# EAGLE design BleHidKeyboard (EAGLE 7.5.0)
DESIGNER: Adam Green
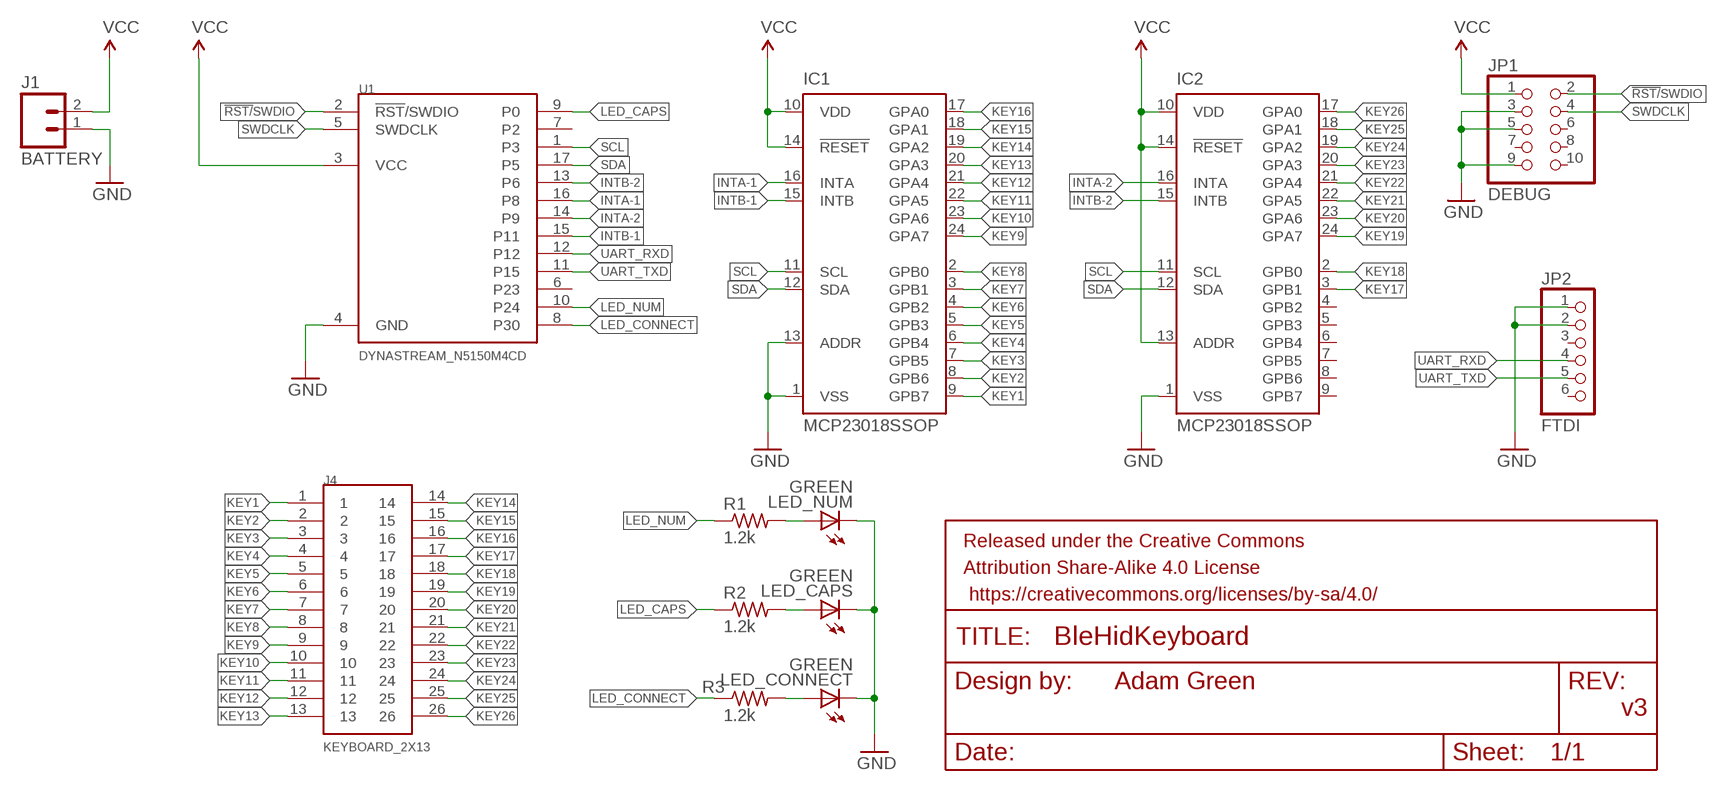
[diagram p0: schematic, sheet 1]

## Parts
IC1  MCP23018SSOP  [SSOP24]
IC2  MCP23018SSOP  [SSOP24]
J1  BATTERY  M021X02_NO_SILK  [1X02_NO_SILK]
J4  KEYBOARD_2X13  [KEYBOARD_2X13]
JP1  DEBUG  FTSH-105  [FTSH-105]
JP2  FTDI  PINHD-1X6CLEAN  [1X06-CLEAN]
LED_CAPS  GREEN  LEDCHIPLED_1206  [CHIPLED_1206]
LED_CONNECT  GREEN  LEDCHIPLED_1206  [CHIPLED_1206]
LED_NUM  GREEN  LEDCHIPLED_1206  [CHIPLED_1206]
R1  1.2k  R-US_R0805  [R0805]
R2  1.2k  R-US_R0805  [R0805]
R3  1.2k  R-US_R0805  [R0805]
U1  DYNASTREAM_N5150M4CD  [N5150M4CD]

## Nets
!RST/!SWDIO: JP1.2 U1.2(!RST!/SWDIO)
GND [POWER]: IC1.1(VSS) IC1.13(ADDR) IC2.1(VSS) J1.1 JP1.3 JP1.5 JP1.9 JP2.1 JP2.2 LED_CAPS.C LED_CONNECT.C LED_NUM.C U1.4(GND)
INTA-1: IC1.16(INTA) U1.16(P8)
INTA-2: IC2.16(INTA) U1.14(P9)
INTB-1: IC1.15(INTB) U1.15(P11)
INTB-2: IC2.15(INTB) U1.13(P6)
KEY1: IC1.9(GPB7) J4.1
KEY2: IC1.8(GPB6) J4.2
KEY3: IC1.7(GPB5) J4.3
KEY4: IC1.6(GPB4) J4.4
KEY5: IC1.5(GPB3) J4.5
KEY6: IC1.4(GPB2) J4.6
KEY7: IC1.3(GPB1) J4.7
KEY8: IC1.2(GPB0) J4.8
KEY9: IC1.24(GPA7) J4.9
KEY10: IC1.23(GPA6) J4.10
KEY11: IC1.22(GPA5) J4.11
KEY12: IC1.21(GPA4) J4.12
KEY13: IC1.20(GPA3) J4.13
KEY14: IC1.19(GPA2) J4.14
KEY15: IC1.18(GPA1) J4.15
KEY16: IC1.17(GPA0) J4.16
KEY17: IC2.3(GPB1) J4.17
KEY18: IC2.2(GPB0) J4.18
KEY19: IC2.24(GPA7) J4.19
KEY20: IC2.23(GPA6) J4.20
KEY21: IC2.22(GPA5) J4.21
KEY22: IC2.21(GPA4) J4.22
KEY23: IC2.20(GPA3) J4.23
KEY24: IC2.19(GPA2) J4.24
KEY25: IC2.18(GPA1) J4.25
KEY26: IC2.17(GPA0) J4.26
LED_CAPS: R2.1 U1.9(P0)
LED_CONNECT: R3.1 U1.8(P30)
LED_NUM: R1.1 U1.10(P24)
N$1: LED_NUM.A R1.2
N$3: LED_CAPS.A R2.2
N$5: LED_CONNECT.A R3.2
SCL: IC1.11(SCL) IC2.11(SCL) U1.1(P3)
SDA: IC1.12(SDA) IC2.12(SDA) U1.17(P5)
SWDCLK: JP1.4 U1.5(SWDCLK)
UART_RXD: JP2.4 U1.12
UART_TXD: JP2.5 U1.11(P15)
VCC [POWER]: IC1.10(VDD) IC1.14(!RESET) IC2.10(VDD) IC2.13(ADDR) IC2.14(!RESET) J1.2 JP1.1 U1.3(VCC)
Unconnected: IC2.4(GPB2) IC2.5(GPB3) IC2.6(GPB4) IC2.7(GPB5) IC2.8(GPB6) IC2.9(GPB7) JP1.6 JP1.7 JP1.8 JP1.10 JP2.3 JP2.6 U1.6(P23) U1.7(P2)

## Notes on the sheet
- v3

## Library data of the parts
IC1 IC2 = adam_custom:MCP23018: http://ww1.microchip.com/downloads/en/DeviceDoc/21952a.pdf Source: http://ww1.microchip.com/downloads/en/DeviceDoc/21952a.pdf
J1 = SparkFun-Connectors:M02: Standard 2-pin 0.1" header. Use with - straight break away headers ( PRT-00116) - right angle break away headers (PRT-00553) - swiss pins (PRT-00743) - machine pins (PRT-00117) - female headers (PRT-00115) Molex polarized connector foot print use with: PRT-08233 with associated crimp pins and housings. 2.54_SCREWTERM for use with PRT-10571. 3.5mm Screw Terminal footprints for PRT-08084 5mm Screw Terminal footprints for use with PRT-08432
J4 = adam_custom:KEYBOARD_2X13
JP1 = adam_custom:FTSH-105: Semtec FSH-105 2x5 SMT Micro Header Commonly used for 10-pin ARM Cortex-M JTAG/SWD Debug Header.
JP2 = adafruit:PINHD-1X6: PIN HEADER
LED_CAPS LED_CONNECT LED_NUM = adafruit:LED: LED OSRAM: - CHIPLED LG R971, LG N971, LY N971, LG Q971, LY Q971, LO R971, LY R971 LH N974, LH R974 LS Q976, LO Q976, LY Q976 LO Q996 - Hyper CHIPLED LW Q18S LB Q993, LB Q99A, LB R99A - SideLED LS A670, LO A670, LY A670, LG A670, LP A670 LB A673, LV A673, LT A673, LW A673 LH A674 LY A675 LS A676, LA A676, LO A676, LY A676, LW A676 LS A679, LY A679, LG A679 - Hyper Micro SIDELED® LS Y876, LA Y876, LO Y876, LY Y876 LT Y87S - SmartLED LW L88C, LW L88S LB L89C, LB L89S, LG L890 LS L89K, LO L89K, LY L89K LS L896, LA L896, LO L896, LY L896 - TOPLED LS T670, LO T670, LY T670, LG T670, LP T670 LSG T670, LSP T670, LSY T670, LOP T670, LYG T670 LG T671, LOG T671, LSG T671 LB T673, LV T673, LT T673, LW T673 LH T674 LS T676, LA T676, LO T676, LY T676, LB T676, LH T676, LSB T676, LW T676 LB T67C, LV T67C, LT T67C, LS T67K, LO T67K, LY T67K, LW E67C LS E67B, LA E67B, LO E67B, LY E67B, LB E67C, LV E67C, LT E67C LW T67C LS T679, LY T679, LG T679 LS T770, LO T770, LY T770, LG T770, LP T770 LB T773, LV T773, LT T773, LW T773 LH T774 LS E675, LA E675, LY E675, LS T675 LS T776, LA T776, LO T776, LY T776, LB T776 LHGB T686 LT T68C, LB T68C - Hyper Mini TOPLED® LB M676 - Mini TOPLED Santana® LG M470 LS M47K, LO M47K, LY M47K Source: http://www.osram.convergy.de/
R1-R3 = rcl:R-US_: RESISTOR, American symbol
U1 = adam_custom:DYNASTREAM_N5150M4CD

## Net classes
0 default: width 0.152 mm, clearance 0.152 mm
1 POWER: width 0.254 mm, clearance 0.152 mm

## Board
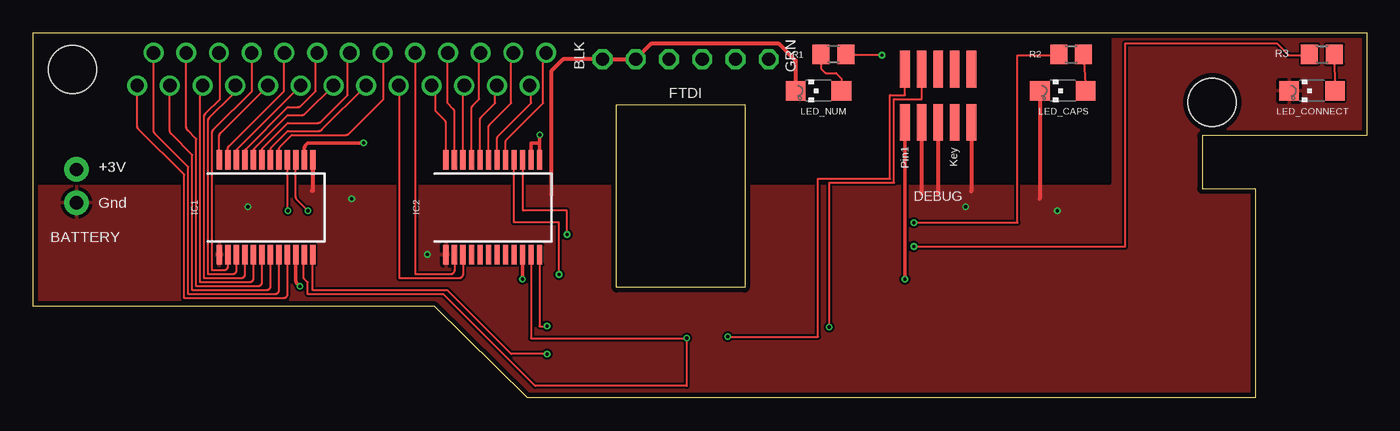
[diagram p1: board, top side]
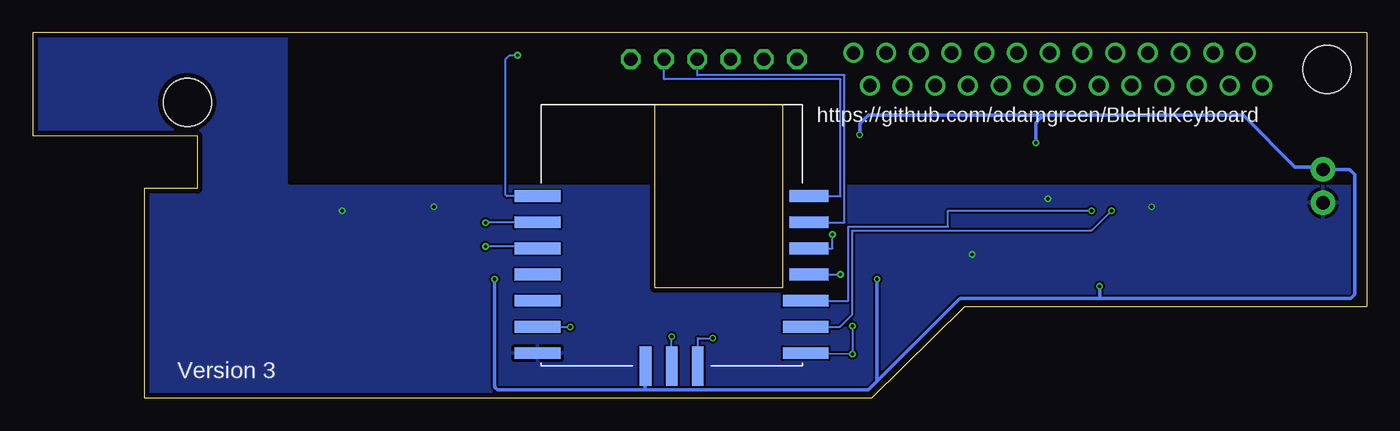
[diagram p2: board, bottom side, seen from below]

Size 101.98 x 27.94 mm. Coordinates in mm from the lower left corner, seen from the top.
Outline: 0,27.94 0,6.99 30.73,6.99 37.85,0 93.47,0 93.47,16 89.41,16 89.41,20.07 101.98,20.07 101.98,27.94 0,27.94
Copper layers (1*16): Top 0.035559375mm / dielectric 1.6mm / Bottom 0.035559375mm
Design rules "oshpark-2layer": minimum track width 6mil, minimum drill 10mil, track to track 6mil, track to pad 6mil, pad to pad 6mil, via to via 6mil, smd to smd 6mil, copper to edge 15mil, drill to drill 6mil, minimum pad ring 5mil, minimum via ring 5mil, stop-mask expansion 2.5mil, vias tented up to drill 0mil, thermal gap 10mil
Holes 3.68 mm at 3.05,25.15 90.17,22.61

### Footprints (pad centres in the part's own frame; a part is rotated, then mirrored left to right if it is on the bottom)
SSOP24 = smd 0.4 x 1.5: 1 -4.225,-3.625; 2 -3.575,-3.625; 3 -2.925,-3.625; 4 -2.275,-3.625; 5 -1.625,-3.625; 6 -0.975,-3.625; 7 -0.325,-3.625; 8 0.325,-3.625; 9 0.975,-3.625; 10 1.625,-3.625; 11 2.275,-3.625; 12 2.925,-3.625; 13 2.925,3.625; 14 2.275,3.625; 15 1.625,3.625; 16 0.975,3.625; 17 0.325,3.625; 18 -0.325,3.625; 19 -0.975,3.625; 20 -1.625,3.625; 21 -2.275,3.625; 22 -2.925,3.625; 23 -3.575,3.625; 24 -4.225,3.625
1X02_NO_SILK = drill 1.016 pad 1.88: 1 0,0; 2 2.54,0
KEYBOARD_2X13 = drill 1.016: 1 -15,-1.25; 2 -13.75,1.25; 3 -12.5,-1.25; 4 -11.25,1.25; 5 -10,-1.25; 6 -8.75,1.25; 7 -7.5,-1.25; 8 -6.25,1.25; 9 -5,-1.25; 10 -3.75,1.25; 11 -2.5,-1.25; 12 -1.25,1.25; 13 0,-1.25; 14 1.25,1.25; 15 2.5,-1.25; 16 3.75,1.25; 17 5,-1.25; 18 6.25,1.25; 19 7.5,-1.25; 20 8.75,1.25; 21 10,-1.25; 22 11.25,1.25; 23 12.5,-1.25; 24 13.75,1.25; 25 15,-1.25; 26 16.25,1.25
FTSH-105 = smd 0.737 x 2.794: 1 -2.54,-2.032; 2 -2.54,2.032; 3 -1.27,-2.032; 4 -1.27,2.032; 5 0,-2.032; 6 0,2.032; 7 1.27,-2.032; 8 1.27,2.032; 9 2.54,-2.032; 10 2.54,2.032
1X06-CLEAN = drill 1.016 octagon: 1 -6.35,0; 2 -3.81,0; 3 -1.27,0; 4 1.27,0; 5 3.81,0; 6 6.35,0
CHIPLED_1206 = smd 1.5 x 1.5: A 0,-1.75; C 0,1.75
R0805 = smd 1.3 x 1.5: 1 -0.95,0; 2 0.95,0
N5150M4CD = smd 0.9 x 3 bottom: 1 -2,-10; 2 0,-10; 3 2,-10 | smd 3.5 x 0.9 bottom: 4 10.25,-9; 5 10.25,-7; 6 10.25,-5; 7 10.25,-3; 8 10.25,-1; 9 10.25,1; 10 10.25,3; 15 -10.25,-5; 16 -10.25,-7; 17 -10.25,-9 | smd 3 x 0.9 bottom: 11 -10.5,3; 12 -10.5,1; 13 -10.5,-1; 14 -10.5,-3

### Placement (x,y rotation side)
IC1  18.49,14.58 0 top
IC2  35.81,14.58 0 top
J1  3.35,14.94 90 top
J4  22.99,25.15 0 top
JP1  69.22,23.11 0 top
JP2  49.91,25.91 0 top
LED_CAPS  78.74,23.5 90 top
LED_CONNECT  97.79,23.5 90 top
LED_NUM  60.07,23.5 90 top
R1  61.21,26.29 180 top
R2  79.38,26.29 0 top
R3  98.55,26.29 0 top
U1  53.14,12.43 0 top

### Tracks (layer width: path | path; a pad name or v marks a point on that pad's centre or on a via)
!RST/!SWDIO  (via drill 0.25)
  Top 0.152: v53.14,4.69 60.05,4.69 60.05,16.76 65.53,16.76 65.53,23.16 66.67,23.16 JP1.2
  Bottom 0.152: U1.2 v53.14,4.69
GND  (via drill 0.25)
  Top 0.305: JP1.3 67.94,15.61 | JP1.5 69.22,15.61 | JP1.9 71.75,15.8 | LED_CAPS.C 76.99,15.25 | 39.62,15.54 39.62,24.99 40.54,25.91 JP2.1 JP2.2 47.32,27.13 57,27.13 58.32,25.8 LED_NUM.C | IC1.13 21.42,15.85 21.34,15.85
  other vias: 16.46,14.63 24.38,15.24 30.18,10.97 71.32,14.63 78.33,14.33
  pour Bottom: 0,16.15 82.28,16.15 arc90 82.6,16.47 82.6,28.04 101.79,28.04 arc-90 102.11,27.72 102.11,19.81 89.61,19.81 arc-90 89.31,20.12 89.31,15.85 93.57,15.85 93.57,0 37.8,0 30.78,7.01 0.32,7.01 arc-90 0,7.33
  pour Top: 0,16.15 82.28,16.15 arc90 82.6,16.47 82.6,27.74 101.79,27.74 arc-90 102.11,27.42 102.11,20.12 89.61,20.12 arc90 89.31,19.81 89.31,16.15 92.95,16.15 arc-90 93.27,15.84 93.27,0 37.8,0 30.78,7.01 0.32,7.01 arc-90 0,7.33
INTA-1  (via drill 0.25 pad 0.51)
  Top 0.152: v19.51,14.33 19.51,18.11 arc45 IC1.16
  Bottom 0.152: v19.51,14.33 20.94,12.89 arc45 21.16,12.8 39.32,12.8 39.32,6.4 40.29,5.43 U1.16
INTA-2  (via drill 0.25)
  Top 0.152: 36.8,18.17 arc45 IC2.16 36.78,13.44 40.23,13.44 v40.23,9.45
  Bottom 0.152: U1.14 40.23,9.43 v40.23,9.45
INTB-1  (via drill 0.25 pad 0.51)
  Top 0.152: v21.03,14.33 20.21,15.15 arc-45 20.12,15.37 IC1.15
  Bottom 0.152: v21.03,14.33 32,14.33 32,13.11 39.62,13.11 39.62,7.43 U1.15
INTB-2  (via drill 0.25)
  Top 0.152: 37.47,18.14 arc45 IC2.15 37.49,18.2 37.49,14.33 40.84,14.33 v40.84,12.5
  Bottom 0.152: U1.13 40.84,11.43 v40.84,12.5
KEY1
  Top 0.152: IC1.9 19.47,7.94 arc-90 19.15,7.62 11.58,7.62 11.58,17.07 8.08,20.57 arc-45 7.99,20.8 J4.1
KEY2
  Top 0.152: IC1.8 18.82,8.24 arc-90 18.5,7.92 11.89,7.92 11.89,17.68 9.33,20.24 arc-45 9.24,20.46 J4.2
KEY3
  Top 0.152: IC1.7 18.17,8.55 arc-90 17.85,8.23 12.19,8.23 12.19,18.59 10.58,20.2 arc-45 10.49,20.43 J4.3
KEY4
  Top 0.152: IC1.6 17.52,8.85 arc-90 17.2,8.53 12.5,8.53 12.5,19.81 11.83,20.48 arc-45 11.74,20.7 J4.4
KEY5
  Top 0.152: IC1.5 16.87,9.16 arc-90 16.55,8.84 12.8,8.84 12.8,23.58 arc-45 12.89,23.8 J4.5
KEY6
  Top 0.152: IC1.4 16.22,9.46 arc-90 15.9,9.14 13.11,9.14 13.11,21.51 arc-45 13.2,21.73 14.33,22.86 14.33,26.18 arc45 J4.6
KEY7
  Top 0.152: IC1.3 15.57,9.77 arc-90 15.25,9.45 13.41,9.45 13.41,21.2 arc-45 13.5,21.43 15.24,23.16 15.24,23.52 arc-45 15.33,23.74 J4.7
KEY8
  Top 0.152: IC1.2 14.92,10.07 arc-90 14.6,9.75 13.72,9.75 13.72,20.29 arc-45 13.81,20.52 16.76,23.47 16.76,26.33 arc45 J4.8
KEY9
  Top 0.152: IC1.24 14.27,20.04 arc-45 14.36,20.27 J4.9
KEY10
  Top 0.152: IC1.23 14.92,19.05 arc-45 15.01,19.28 19.2,23.47 19.2,26.31 arc-45 J4.10
KEY11
  Top 0.152: IC1.22 15.57,18.84 arc-45 15.66,19.07 J4.11
KEY12
  Top 0.152: IC1.21 16.22,18.83 arc-45 16.31,19.05 19.51,22.25 20.29,22.25 arc45 20.52,22.34 21.64,23.47 21.64,26.17 arc-45 J4.12
KEY13
  Top 0.152: IC1.20 16.87,18.87 arc-45 16.96,19.09 19.51,21.64 20.6,21.64 arc45 20.82,21.73 J4.13
KEY14
  Top 0.152: IC1.19 17.52,18.91 arc-45 17.61,19.13 19.51,21.03 21.81,21.03 arc45 22.04,21.12 24.08,23.16 24.08,26.11 arc-45 24.17,26.33 J4.14
KEY15
  Top 0.152: IC1.18 18.17,18.95 arc-45 18.26,19.17 19.51,20.42 21.88,20.42 arc45 22.11,20.52 J4.15
KEY16
  Top 0.152: IC1.17 18.82,18.99 arc-45 18.91,19.21 19.81,20.12 23.95,20.12 arc45 24.17,20.21 26.82,22.86 26.82,26.19 arc45 J4.16
KEY17
  Top 0.152: IC2.3 32.89,9.46 arc-90 32.57,9.14 28.04,9.14 28.04,23.84 arc90 J4.17
KEY18
  Top 0.152: IC2.2 32.24,9.77 arc-90 31.92,9.45 29.26,9.45 29.26,26.37 arc90 J4.18
KEY19
  Top 0.152: IC2.24 31.59,21.01 arc45 31.5,21.23 30.79,21.95 30.79,23.47 arc45 30.69,23.69 J4.19
KEY20
  Top 0.152: IC2.23 32.24,21.88 arc45 32.15,22.11 31.7,22.55 31.7,26.3 arc-45 J4.20
KEY21
  Top 0.152: IC2.22 32.89,23.67 arc-45 J4.21
KEY22
  Top 0.152: IC2.21 33.54,22.13 arc-45 33.63,22.35 34.14,22.86 34.14,26.16 arc-45 J4.22
KEY23
  Top 0.152: IC2.20 34.19,21.26 arc-45 34.28,21.48 35.36,22.55 35.36,23.63 arc-45 35.45,23.86 J4.23
KEY24
  Top 0.152: IC2.19 34.84,20.69 arc-45 34.93,20.91 36.58,22.55 36.58,26.1 arc-45 36.67,26.33 J4.24
KEY25
  Top 0.152: IC2.18 35.49,19.81 arc-45 35.58,20.04 38.1,22.55 38.1,23.65 arc45 38.01,23.88 J4.25
KEY26
  Top 0.152: IC2.17 36.14,19.55 arc-45 36.23,19.77 39.01,22.55 39.01,26.04 arc-45 39.11,26.27 J4.26
LED_CAPS  (via drill 0.25)
  Top 0.152: v67.36,13.41 75.29,13.41 75.29,26.21 78.42,26.21 R2.1
  Bottom 0.152: U1.9 63.39,13.41 v67.36,13.41
LED_CONNECT  (via drill 0.25)
  Top 0.152: v67.36,11.58 83.52,11.58 83.52,27.13 95.1,27.13 96.01,26.21 97.53,26.21 R3.1
  Bottom 0.152: U1.8 63.39,11.58 v67.36,11.58
LED_NUM  (via drill 0.25)
  Top 0.152: v64.92,26.21 62.24,26.21 R1.1
  Bottom 0.152: U1.10 65.73,15.43 65.84,15.54 65.84,25.91 65.53,26.21 v64.92,26.21
N$1
  Top 0.152: R1.2 60.26,25.19 60.6,24.85 61.4,24.85 61.82,24.44 LED_NUM.A
N$3
  Top 0.152: R2.2 LED_CAPS.A
N$5
  Top 0.152: R3.2 LED_CONNECT.A
SCL  (via drill 0.25)
  Top 0.152: IC1.11 20.73,10.91 20.73,9.14 21.03,8.84 21.03,7.92 31.39,7.92 38.41,0.91 49.99,0.91 v49.99,4.57 38.09,4.57 IC2.11
  Bottom 0.152: U1.1 51.14,4.57 v49.99,4.57
SDA  (via drill 0.25)
  Top 0.152: v39.32,3.35 36.58,3.35 31.7,8.23 21.42,8.23 IC1.12 | IC2.12 38.74,5.49 v39.32,5.49
  Bottom 0.152: U1.17 v39.32,3.35 v39.32,5.49
SWDCLK  (via drill 0.25)
  Top 0.152: v60.9,5.42 60.9,16.46 65.84,16.46 65.84,22.86 67.97,22.86 67.97,25.15 JP1.4
  Bottom 0.152: U1.5 v60.9,5.42
UART_RXD
  Bottom 0.152: U1.12 39.93,13.43 39.93,24.69 51.18,24.69 JP2.4
UART_TXD
  Bottom 0.152: U1.11 40.23,15.43 40.23,24.38 53.72,24.38 JP2.5
VCC  (via drill 0.25 pad 0.51)
  Top 0.254: IC1.10 20.12,8.97 arc45 20.21,8.75 v20.42,8.53 | IC2.10 v37.44,9.09 | JP1.1 v66.67,9.09 | IC1.14 20.77,19.11 arc-45 20.86,19.34 21.03,19.51 v25.3,19.51 | IC2.13 38.74,19.51 | 38.74,19.51 38.74,20.07 arc-45 v38.76,20.12 | IC2.14 38.09,19.48 arc-45 38.1,19.51 38.74,19.51
  Bottom 0.254: 20.42,7.62 1.22,7.62 1.01,7.83 arc-45 0.91,8.06 0.91,17.07 1.23,17.38 arc-45 1.45,17.48 J1.2 3.46,17.59 arc-45 3.69,17.68 5.49,17.68 9.36,21.55 arc-45 9.58,21.64 24.69,21.64 | 20.42,7.62 30.96,7.62 arc-45 31.18,7.53 37.44,1.27 | 55.17,0.61 38.1,0.61 37.49,1.22 37.44,1.27 | 55.17,0.61 66.45,0.61 66.58,0.74 arc45 66.67,0.97 v66.67,9.09 | v20.42,8.53 20.42,7.62 | v25.3,19.51 25.3,20.9 arc45 25.2,21.12 24.69,21.64 | v38.76,20.12 38.76,20.85 arc45 38.67,21.07 38.1,21.64 24.69,21.64 | U1.3 55.17,0.61 | v37.44,9.09 37.44,1.27

### Text on the board
bPlace: https://github.com/adamgreen/BleHidKeyboard | Version 3
tNames: BLK | GRN | +3V | Pin1 | Key | Gnd